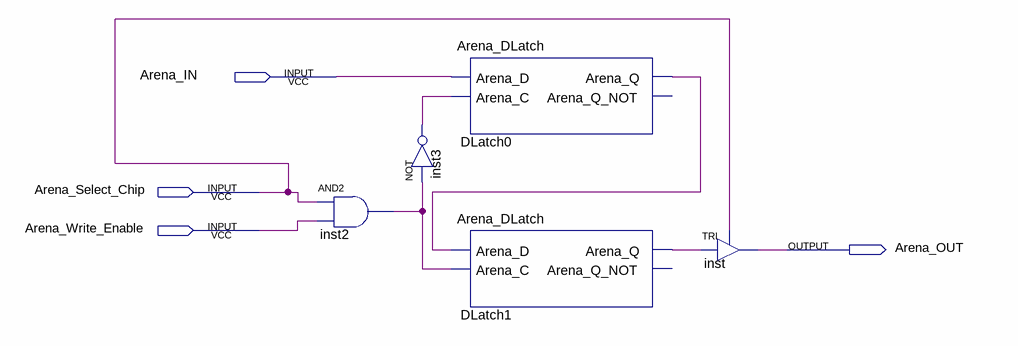
[diagram p0: schematic sheet]
// Quartus schematic Arena_SRAM.bdf as structural Verilog: 5 symbols, 4 pins
module Arena_SRAM (
  input  Arena_IN,
  input  Arena_Select_Chip,
  input  Arena_Write_Enable,
  output Arena_OUT
);

  wire DLatch0_arena_q, DLatch1_arena_q, inst2_out, inst3_out;

  and inst2 (inst2_out, Arena_Select_Chip, Arena_Write_Enable);
  not inst3 (inst3_out, inst2_out);
  Arena_DLatch DLatch0 (.Arena_D(Arena_IN), .Arena_C(inst3_out), .Arena_Q(DLatch0_arena_q));  // open: Arena_Q_NOT
  Arena_DLatch DLatch1 (
    .Arena_D(DLatch0_arena_q), .Arena_C(inst2_out), .Arena_Q(DLatch1_arena_q));  // open: Arena_Q_NOT
  TRI inst (.IN(DLatch1_arena_q), .OE(Arena_Select_Chip), .OUT(Arena_OUT));
endmodule
